# Altium schematic sheet Sheet1_Young.SchDoc: Auto balance vehicle
size A4; DrawnBy: Micls; DocumentNumber: 9999; Revision: 3; SheetNumber: 1; SheetTotal: 1
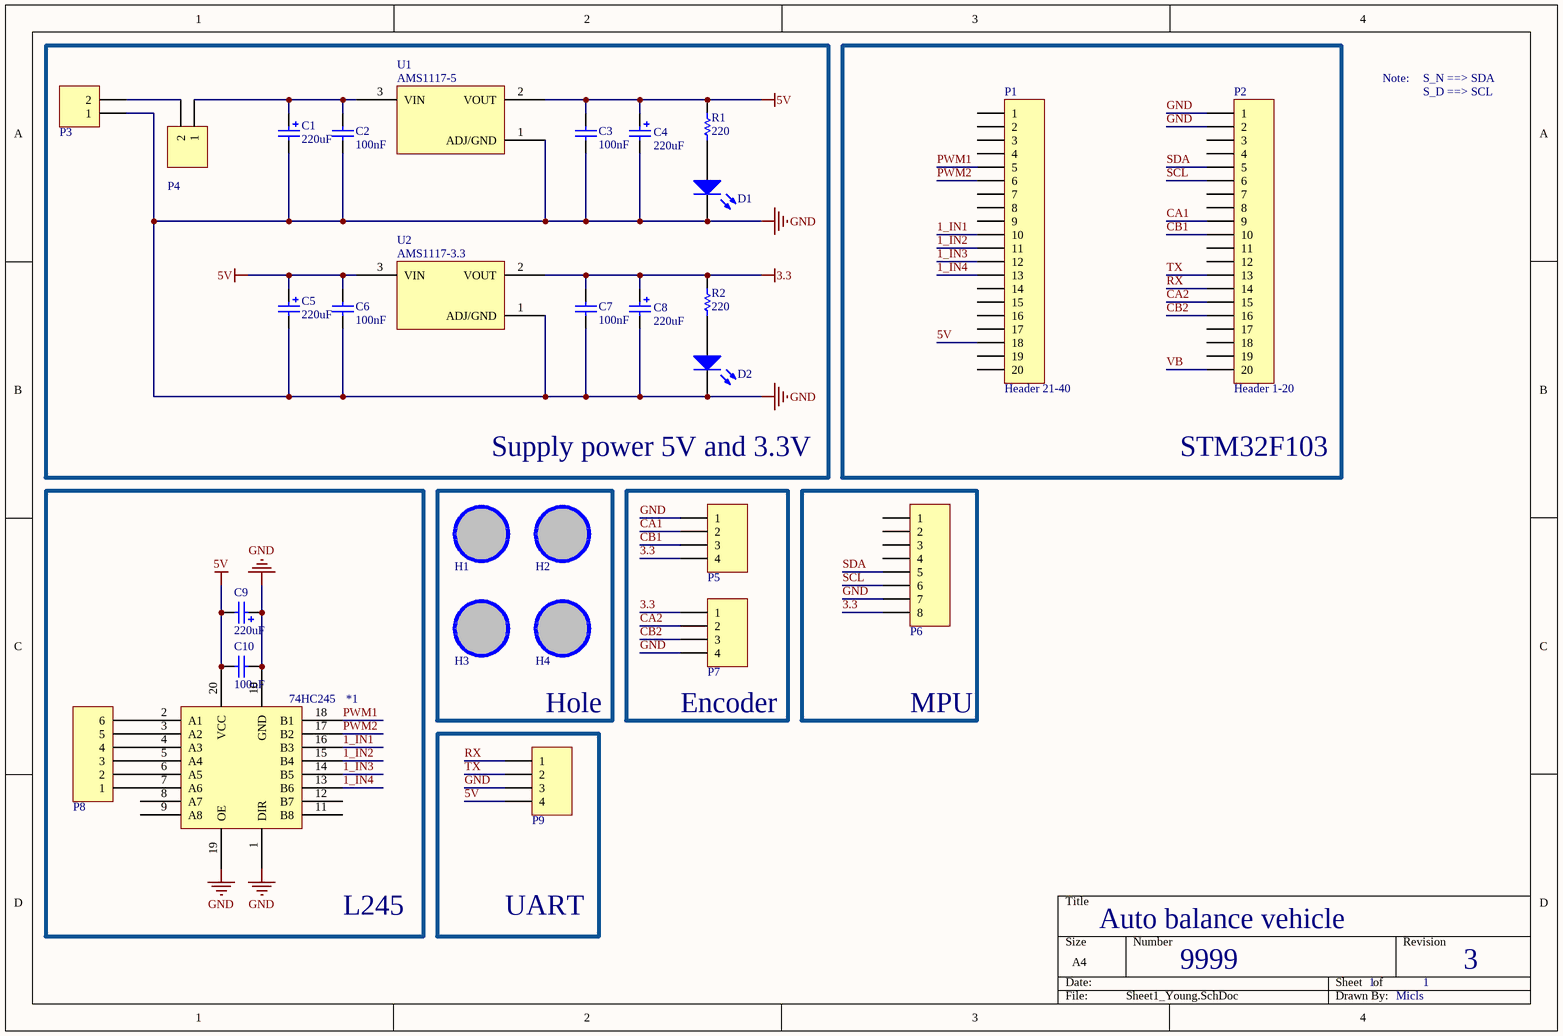
[diagram p0: Sheet1_Young.SchDoc]

## Parts
*1  74HC245  [DIP20-3D]
C1  value 220uF  [CAP ALU SIZE B]  (hidden comment: Cap Pol SMD)
C2  value 100nF  [CAP-SM-0805]  (hidden comment: Cap Non-Pol SMD)
C3  value 100nF  [CAP-SM-0805]  (hidden comment: Cap Non-Pol SMD)
C4  value 220uF  [CAP ALU SIZE B]  (hidden comment: Cap Pol SMD)
C5  value 220uF  [CAP ALU SIZE B]  (hidden comment: Cap Pol SMD)
C6  value 100nF  [CAP-SM-0805]  (hidden comment: Cap Non-Pol SMD)
C7  value 100nF  [CAP-SM-0805]  (hidden comment: Cap Non-Pol SMD)
C8  value 220uF  [CAP ALU SIZE B]  (hidden comment: Cap Pol SMD)
C9  value 220uF  [CAP ALU SIZE B]  (hidden comment: Cap Pol SMD)
C10  value 100nF  [CAP-SM-0805]  (hidden comment: Cap Non-Pol SMD)
D1  LED SMD  [LED_0805_Blue]  (value not drawn)
D2  LED SMD  [LED_0805_Blue]  (value not drawn)
H1  Hole  [LO KHOAN 3MM]  (value not drawn)
H2  Hole  [LO KHOAN 3MM]  (value not drawn)
H3  Hole  [LO KHOAN 3MM]  (value not drawn)
H4  Hole  [LO KHOAN 3MM]  (value not drawn)
P1  Header 21-40  [HDR1X20]
P2  Header 1-20  [HDR1X20]
P3  Domino 2  [DOMINO 2- 5mm]  (value not drawn)
P4  Domino 2  [DOMINO 2- 5mm]  (value not drawn)
P5  Header 4  [JP4]  (value not drawn)
P6  Header 8  [JP8]  (value not drawn)
P7  Header 4  [JP4]  (value not drawn)
P8  Header 6  [JP6]  (value not drawn)
P9  Header 4  [JP4]  (value not drawn)
R1  value 220  [RES-SM-0805]  (hidden comment: RESISTOR SMD)
R2  value 220  [RES-SM-0805]  (hidden comment: RESISTOR SMD)
U1  AMS1117-5  [SOT230P700X180-4N]
U2  AMS1117-3.3  [SOT230P700X180-4N]

## Blocks framed on the sheet
Supply power 5V and 3.3V: C1-C8 D1 D2 P3 P4 R1 R2 U1 U2
STM32F103: P1 P2
L245: *1 C9 C10 P8
Hole: H1-H4
Encoder: P5 P7
MPU: P6

## Nets
3.3: C7.1 C8.1 P5.4 P6.8 P7.1 R2.2 U2.2(VOUT)
5V: *1.20(VCC) C3.1 C4.1 C5.1 C6.2 C9.2 C10.1 P1.18 P9.4 R1.2 U1.2(VOUT) U2.3(VIN)
GND: *1.1(DIR) *1.10(GND) *1.19(OE) C1.2 C2.1 C3.2 C4.2 C5.2 C6.1 C7.2 C8.2 C9.1 C10.2 D1.2(K) D2.2(K) P2.1 P2.2 P3.1 P5.1 P6.7 P7.4 P9.3 U1.1(ADJ/GND) U2.1(ADJ/GND)
1_IN1: *1.16(B3) P1.10
1_IN2: *1.15(B4) P1.11
1_IN3: *1.14(B5) P1.12
1_IN4: *1.13(B6) P1.13
CA1: P2.9 P5.2
CA2: P2.15 P7.2
CB1: P2.10 P5.3
CB2: P2.16 P7.3
PWM1: *1.18(B1) P1.5
PWM2: *1.17(B2) P1.6
RX: P2.14 P9.1
SCL: P2.6 P6.6
SDA: P2.5 P6.5
TX: P2.13 P9.2
VB: P2.20
Net*1_2: *1.2(A1) P8.6
Net*1_3: *1.3(A2) P8.5
Net*1_4: *1.4(A3) P8.4
Net*1_5: *1.5(A4) P8.3
Net*1_6: *1.6(A5) P8.2
Net*1_7: *1.7(A6) P8.1
NetC1_1: C1.1 C2.2 P4.1 U1.3(VIN)
NetD1_1: D1.1(A) R1.1
NetD2_1: D2.1(A) R2.1
NetP3_2: P3.2 P4.2

Not connected (* = marked no-connect by the designer): *1 8(A7) 9(A8) 11(B8) 12(B7); H1 1; H2 1; H3 1; H4 1; P1 1 2 3 4 7 8 9 14 15 16 17 19 20; P2 3 4 7 8 11 12 17 18 19; P6 1 2 3 4

## Notes on the sheet
- Note:
- S_N ==> SDA
- S_D ==> SCL
- UART
- 1

## Library data of the parts
C1 C4 C5 C8 C9 = Cap Pol SMD: Polarized Capacitor (Radial)
C2 C3 C6 C7 C10 = Cap Non-Pol SMD: Capacitor
D1 D2 = LED SMD: LED
H1-H4 = Hole: Hole 3mm
P1 P2 = Header 20: Header, 20-Pin; LatestRevisionDate: 17-Jul-2002; LatestRevisionNote: Re-released for DXP Platform.; Publisher: Altium Limited
P3 P4 = Domino 2: Domino, 2-Pin; LatestRevisionDate: 17-Jul-2002; LatestRevisionNote: Re-released for DXP Platform.; Publisher: Altium Limited
P5 P7 P9 = Header 4: Header, 4-Pin; LatestRevisionDate: 17-Jul-2002; LatestRevisionNote: Re-released for DXP Platform.; Publisher: Altium Limited
P6 = Header 8: Header, 8-Pin; LatestRevisionDate: 17-Jul-2002; LatestRevisionNote: Re-released for DXP Platform.; Publisher: Altium Limited
P8 = Header 6: Header, 6-Pin; LatestRevisionDate: 17-Jul-2002; LatestRevisionNote: Re-released for DXP Platform.; Publisher: Altium Limited
R1 R2 = RESISTOR SMD: Resistor
U1 U2 = AMS1117-3.3: MF: NEC; Price: None; SnapEDA_Link: https://www.snapeda.com/parts/AMS1117-3.3/NEC/view-part/?ref=snap; Availability: Unavailable; MP: AMS1117-3.3; Package: None; Value: *